# Altium schematic sheet Power.SchDoc
size A4; SheetNumber: 4; SheetTotal: 9
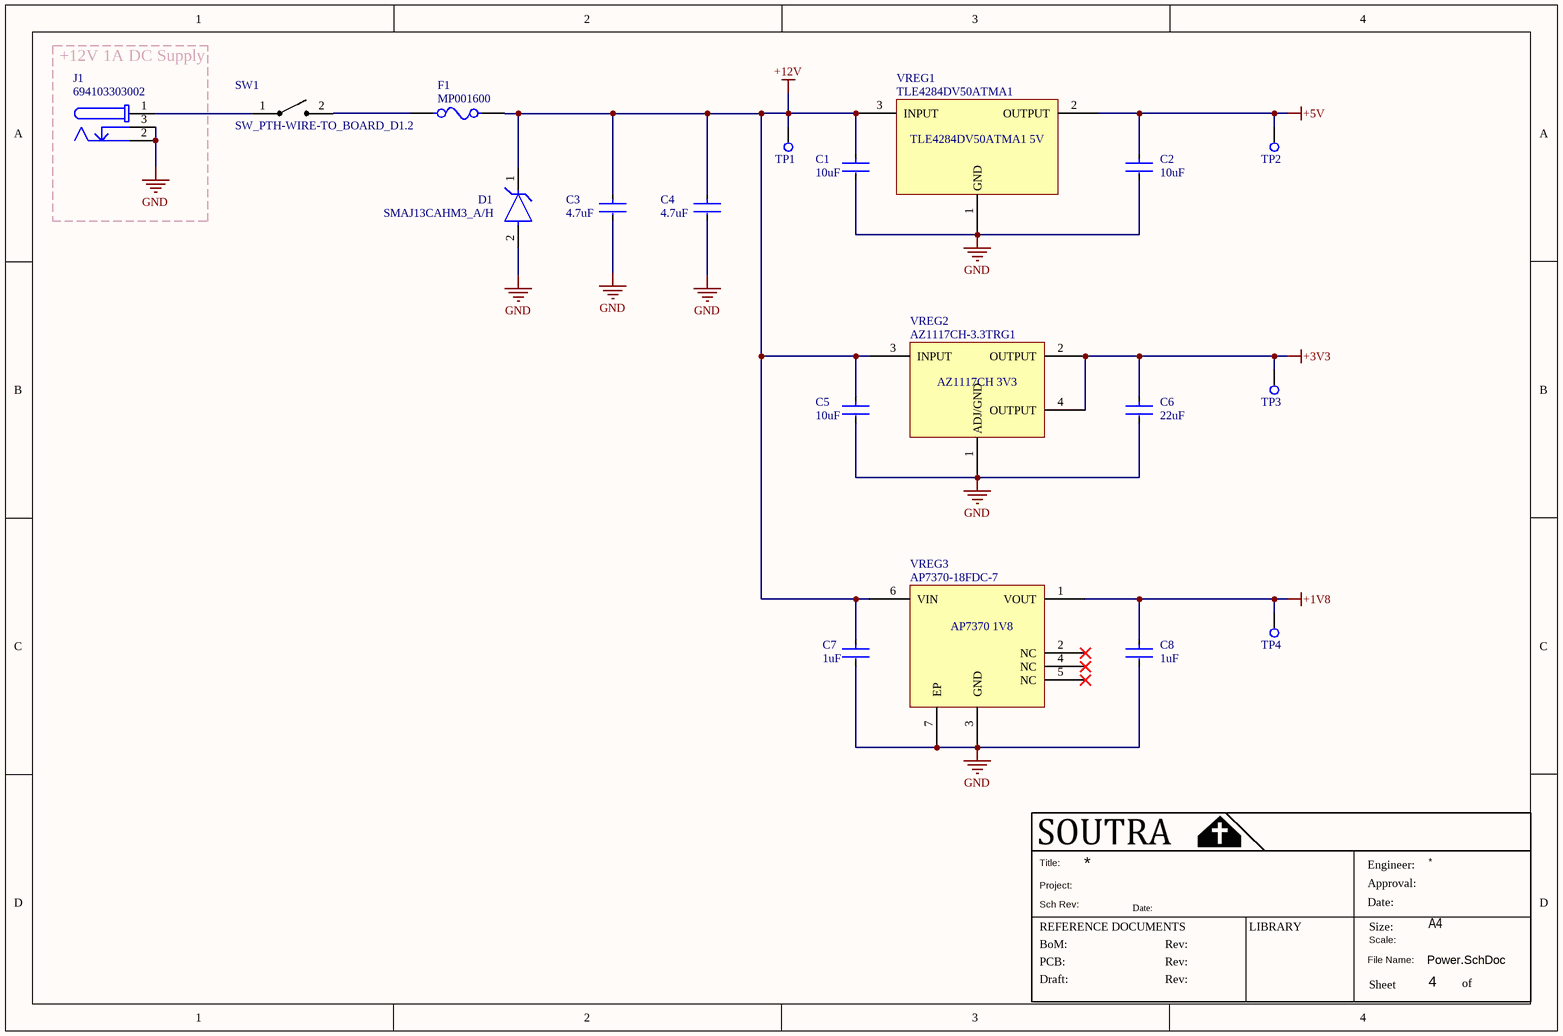
[diagram p0: Power.SchDoc]

## Parts
C1  value 10uF  [CC1206-IPC_A]  (hidden comment: 1206B106K250CP)
C2  value 10uF  [CC1206-IPC_A]  (hidden comment: 1206B106K250CP)
C3  value 4.7uF  [CC1206-IPC_A]  (hidden comment: CL31B475KAHNNNE)
C4  value 4.7uF  [CC1206-IPC_A]  (hidden comment: CL31B475KAHNNNE)
C5  value 10uF  [CC1206-IPC_A]  (hidden comment: 1206B106K250CP)
C6  value 22uF  [CAPC2012X14L]  (hidden comment: GRM21BR61A226ME51L)
C7  value 1uF  [CAPC1005X06L]  (hidden comment: CC0402KRX5R6BB105)
C8  value 1uF  [CAPC1005X06L]  (hidden comment: CC0402KRX5R6BB105)
D1  SMAJ13CAHM3_A/H  [SODFL511X229-2N]
F1  MP001600  [FUSE_3216X08L]
J1  694103303002  [WURTH_694106301002]
SW1  SW_PTH-WIRE-TO_BOARD_D1.2  [SW_PTH-Wire-to-Board-D1.2]
TP1  TP_CIRCLE_R1  [TP_CIRCLE_R1]  (value not drawn)
TP2  TP_CIRCLE_R1  [TP_CIRCLE_R1]  (value not drawn)
TP3  TP_CIRCLE_R1  [TP_CIRCLE_R1]  (value not drawn)
TP4  TP_CIRCLE_R1  [TP_CIRCLE_R1]  (value not drawn)
VREG1  TLE4284DV50ATMA1  [TO252-3-11_L]
VREG2  AZ1117CH-3.3TRG1  [SOT230P700X180-4L]
VREG3  AP7370-18FDC-7  [U-DFN2020EP65P201X201X63_HS-7L]

## Blocks framed on the sheet
+12V 1A DC Supply: J1

## Nets
+1V8: C8.1 TP4.1 VREG3.1(VOUT)
+3V3: C6.1 TP3.1 VREG2.2(OUTPUT) VREG2.4(OUTPUT)
+5V: C2.1 TP2.1 VREG1.2(OUTPUT)
+12V: C1.1 C3.1 C4.1 C5.1 C7.1 D1.1(C) F1.2 TP1.1 VREG1.3(INPUT) VREG2.3(INPUT) VREG3.6(VIN)
GND: C1.2 C2.2 C3.2 C4.2 C5.2 C6.2 C7.2 C8.2 D1.2(A) J1.2 J1.3 VREG1.1(GND) VREG2.1(ADJ/GND) VREG3.3(GND) VREG3.7(EP)
NetF1_1: F1.1 SW1.2
NetJ1_1: J1.1 SW1.1

Not connected (* = marked no-connect by the designer): VREG3 2(NC)* 4(NC)* 5(NC)*

## Notes on the sheet
- Title:
- Project:
- Sch Rev:
- Date:
- Engineer:
- Approval:
- REFERENCE DOCUMENTS
- BoM:
- PCB:
- Draft:
- Rev:
- LIBRARY
- File Name:
- Scale:
- Size:
- Sheet
- A4
- of
- (in symbol AP7370-18FDC-7) AP7370 1V8
- (in symbol AZ1117CH-3.3TRG1) AZ1117CH 3V3
- (in symbol TLE4284DV50ATMA1) TLE4284DV50ATMA1 5V

## Library data of the parts
C1 C2 C5 = 1206B106K250CP: Cap, 10Uf, 25V, Mlcc, 1206 Rohs Compliant: Yes; Manufacturer: Walsin Technologies; Supplier 1: Farnell; Supplier Part Number 1: 3764170; Manufacturer Part Number: 1206B106K250CP; RoHS: No; Stock 1: 1410; Pricing 1: 5=0.114, 50=0.11, 250=0.098, 500=0.096, 1000=0.094 (GBP)
C3 C4 = CL31B475KAHNNNE: Ceramic Capacitor, Multilayer, Ceramic, 25V, 10% +Tol, 10% -Tol, X7R, 15% TC, 4.7uF, Surface Mount, 1206; Manufacturer: Samsung; Multilayer: Yes; Supplier: Digikey; Supplier Part Number: 1276-1055-1-ND; Manufacturer Part Number: CL31B475KAHNNNE; RoHS: Yes; Category: Ceramic Capacitors; Stock: 245034; Pricing: 1=0.18, 10=0.116, 50=0.0732, 100=0.0585, 500=0.04228, 1000=0.0374 (USD); Mounting Technology: Surface Mount; Pins: 2; Dielectric Material: Ceramic; Package Shape: Rectangular; Case/Package: 1206; Terminal Finish: Nickel; Min Operating Temperature: -55°C; Max Operating Temperature: 125°C; JESD-609 Code: e3; Capacitor Type: Ceramic; Tolerance  (fill in as +-): 10%; Package Style: SMTMeter; Packaging: Tape and Reel; Tolerance (fill in as +-): 10%; Rated DC Voltage (URdc): 25V; Temperature Characteristics Code: X7R; Termination: Wraparound; Length: 3.2mm; Width: 1.6mm; Height: 1.8mm; Reach SVHC Compliant: Yes; RoHS Compliant: Yes; ComponentLink1URL: https://datasheet.ciiva.com:443/pdfs/VipMasterIC/IC/SEMS/SEMS-S-A0008522756/SEMS-S-A0008522493-1.pdf?src-supplier=IHS+Markit; ComponentLink1Description: https://datasheet.ciiva.com:443/pdfs/VipMasterIC/IC/SEMS/SEMS-S-A0008522756/SEMS-S-A0008522493-1.pdf?src-supplier=IHS+Markit; ComponentLink2URL: https://datasheet.ciiva.com/25728/cl31b475kahnnne-25728538.pdf?src-supplier=Digikey; ComponentLink2Description: https://datasheet.ciiva.com/25728/cl31b475kahnnne-25728538.pdf?src-supplier=Digikey; ComponentLink3URL: https://datasheet.ciiva.com/29200/452772-da-01-en-vs-kondensator-1206-29200897.pdf?src-supplier=Conrad; ComponentLink3Description: https://datasheet.ciiva.com/29200/452772-da-01-en-vs-kondensator-1206-29200897.pdf?src-supplier=Conrad; ComponentLink4URL: https://datasheet.ciiva.com/29200/452785-da-01-en-vs-kondensator-1206-29200901.pdf?src-supplier=Conrad; ComponentLink4Description: https://datasheet.ciiva.com/29200/452785-da-01-en-vs-kondensator-1206-29200901.pdf?src-supplier=Conrad; ComponentLink5URL: https://datasheet.ciiva.com/26310/mlcc-catalogdownload2013-eng-26310092.pdf?src-supplier=Distrelec; ComponentLink5Description: https://datasheet.ciiva.com/26310/mlcc-catalogdownload2013-eng-26310092.pdf?src-supplier=Distrelec; ComponentLink6URL: https://datasheet.ciiva.com/16428/cl10c1r5bb8nnnc-16428942.pdf?src-supplier=Future+Electronics; ComponentLink6Description: https://datasheet.ciiva.com/16428/cl10c1r5bb8nnnc-16428942.pdf?src-supplier=Future+Electronics; Supplier 1: Farnell; Supplier Part Number 1: 3013532; Pricing 1: 5=0.08, 50=0.05
C6 = GRM21BR61A226ME51L: SMD Multilayer Ceramic Capacitor, 22 µF, 10 V, 0805 [2012 Metric], ± 20%, X5R, GRM Series; Alternative Part: C2012X5R1A226M125AB; Alternative Part Manufacturer: TDK; Manufacturer: Murata; Supplier 1: Farnell; Supplier Part Number 1: 2494270; Pricing 1: 5=0.192, 50=0.09; Stock 1: 79616; Alternative Supplier: Digikey; Alternative Supplier Part Number: 490-10511-1-ND; Pricing 2: 1=0.22, 10=0.14, 50=0.09, 100=0.07; Alternative Part Supplier: Farnell; Alternative Part Supplier Part Number: 2525131; Manufacturer Part Number: GRM21BR61A226ME51L
C7 C8 = CC0402KRX5R6BB105: Ceramic Capacitor, Multilayer, Ceramic, 10V, 10% +Tol, 10% -Tol, X5R, 15% TC, 1uF, Surface Mount, 0402; Manufacturer: Yageo; Alternative Part: 0402ZD105KAT2A; Alternative Part Manufacturer: KYOCERA AVX; Multilayer: Yes; Supplier: Farnell; Supplier Part Number: 1458896; Manufacturer Part Number: CC0402KRX5R6BB105; RoHS: Yes; Category: Ceramic Capacitors; Stock: 12220000; Pricing: 10=0.039, 100=0.023; Mounting Technology: Surface Mount; Pins: 2; Dielectric Material: Ceramic; Package Shape: Rectangular; Case/Package: 0402; Terminal Finish: Nickel; Min Operating Temperature: -55°C; Max Operating Temperature: 85°C; JESD-609 Code: e3; Capacitor Type: Ceramic; Tolerance  (fill in as +-): 10%; Package Style: SMTMeter; Packaging: Tape and Reel; Tolerance (fill in as +-): 10%; Rated DC Voltage (URdc): 10V; Temperature Characteristics Code: X5R; Termination: Wraparound; Length: 1mm; Width: 0.5mm; Height: 0.5mm; Reach SVHC Compliant: Yes; RoHS Compliant: Yes; ComponentLink1URL: https://datasheet.ciiva.com:443/pdfs/VipMasterIC/IC/YAGO/YAGO-S-A0006851646/YAGO-S-A0006851646-1.pdf?src-supplier=IHS+Markit; ComponentLink1Description: https://datasheet.ciiva.com:443/pdfs/VipMasterIC/IC/YAGO/YAGO-S-A0006851646/YAGO-S-A0006851646-1.pdf?src-supplier=IHS+Markit; ComponentLink2URL: https://datasheet.ciiva.com/176/upy-gphc-x5r-4v-to-50v-12-176704.pdf?src-supplier=Digi-Key; ComponentLink2Description: https://datasheet.ciiva.com/176/upy-gphc-x5r-4v-to-50v-12-176704.pdf?src-supplier=Digi-Key; ComponentLink3URL: https://datasheet.ciiva.com/176/mlccorderingcode-176705.pdf?src-supplier=Digi-Key; ComponentLink3Description: https://datasheet.ciiva.com/176/mlccorderingcode-176705.pdf?src-supplier=Digi-Key; ComponentLink4URL: https://datasheet.ciiva.com/176/mlccorderingcode-176706.pdf?src-supplier=Digi-Key; ComponentLink4Description: https://datasheet.ciiva.com/176/mlccorderingcode-176706.pdf?src-supplier=Digi-Key; Supplier 1: Digikey; Supplier Part Number 1: 311-1439-1-ND; Pricing 1: 1=0.08, 10=0.058, 50=0.034, 100=0.027; Alternative Part Supplier: Farnell; Alternative Part Supplier Part Number: 1740588
D1 = SMAJ13CAHM3_A/H: TVS Diode, TRANSZORB SMAJ, Bidirectional, 13 V, 21.5 V, DO-214AC (SMA), 2 Pins; Manufacturer: Vishay; Supplier 1: Farnell; Supplier Part Number 1: 3530003; Pricing 1: 5=0.168, 10=0.146, 100+0.122; Stock 1: 8321; Manufacturer Part Number: SMAJ13CAHM3_A/H
F1 = MP001600: MULTICOMP PRO MP001600Fuse, Surface Mount, 1.5 A, Fast Acting, 72 VDC, 1206 [3216 Metric]; Supplier: Farnell; Supplier Part Number: 3285103; Manufacturer: Multicomp; Manufacturer Part Number: MP001600; RoHS: No; Stock: 2998; Pricing: 5=0.094, 50=0.0739, 250=0.0627, 500=0.0559, 1500=0.0459 (GBP)
J1 = 694103303002: Circular DC Power Connector; Manufacturer: Wurth Electronics; Connector Type: Circular,Power; Supplier: Farnell; Supplier Part Number: 2472149; Manufacturer Part Number: 694103303002; RoHS: Yes; Category: Connectors; Stock: 6324; Pricing: 1=1.14, 10=0.84, 100=0.78; Contact Finish - Mating: NOT SPECIFIED; Reach SVHC Compliant: Yes; RoHS Compliant: Yes; ComponentLink1URL: https://datasheet.ciiva.com:443/pdfs/VipMasterIC/IC/MIDC/MIDC-S-A0001193031/MIDC-S-A0001193031-1.pdf?src-supplier=IHS+Markit; ComponentLink1Description: https://datasheet.ciiva.com:443/pdfs/VipMasterIC/IC/MIDC/MIDC-S-A0001193031/MIDC-S-A0001193031-1.pdf?src-supplier=IHS+Markit; ComponentLink2URL: http://www.mouser.com/ds/2/445/6941xx303002-469289.pdf?src-supplier=Mouser; ComponentLink2Description: http://www.mouser.com/ds/2/445/6941xx303002-469289.pdf?src-supplier=Mouser; ComponentLink3URL: http://www.farnell.com/cad/2130963.pdf?src-supplier=Element14; ComponentLink3Description: http://www.farnell.com/cad/2130963.pdf?src-supplier=Element14; ComponentLink4URL: https://katalog.we-online.de/em/datasheet/6941xx303002.pdf?src-supplier=Digikey; ComponentLink4Description: https://katalog.we-online.de/em/datasheet/6941xx303002.pdf?src-supplier=Digikey; Supplier 1: Digikey; Supplier Part Number 1: 732-5930-ND; Stock 1: 11140; Pricing 1: 1=0.81, 10=0.77, 50=0.68, 100=0.63
SW1 = SW_PTH-WIRE-TO_BOARD_D1.2: PTH Mounting Holes for Wire-to-board switch, 1.2mm diameter, >=17AWG
TP1-TP4 = TP_CIRCLE_R1: Test Point, SMD, Circular, Radius = 1mm
VREG1 = TLE4284DV50ATMA1: Manufacturer: Infineon; Supplier 1: Farnell; Supplier Part Number 1: TLE4284DV50ATMA1; Pricing 1: 5=1.49, 50=1.38, 100=1.27; Stock 1: 24605; Manufacturer Part Number: TLE4284DV50ATMA1
VREG2 = AZ1117CH-3.3TRG1: Fixed Positive LDO Regulator, 3.3V, 1.3V Dropout, BIPolar, PDSO3; Manufacturer: Diodes; Package Body Material: Plastic; Dropout Voltage1-Nom: 1.2V; Input Voltage Absolute-Max: 18V; Max Supply Voltage: 15V; Line Regulation-Max: 0.01%; Load Regulation-Max: 0.015%; Channels: 1; Output Current1-Max: 800mA; Output Voltage1-Max: 3.365V; Output Voltage1-Min: 3.235V; Regulator Type: FIXED POSITIVE SINGLE OUTPUT LDO REGULATOR; Voltage Tolerance-Max: 1.97%; Qualification Status: Not Qualified; Supplier: Farnell; Supplier Part Number: 3483073; Manufacturer Part Number: AZ1117CH-3.3TRG1; RoHS: Yes; Category: Voltage Regulators - Linear; Stock: 8830; Pricing: 5=0.42, 10=0.25, 100=0.12; Case/Package: SOP; Pins: 3; Package Shape: Rectangular; Terminal Finish: Tin; JESD-609 Code: e3; Adjustability: FIXED; Dropout Voltage1-Max: 1.3V; JESD-30 Code: R-PDSO-G3; Moisture Sensitivity Level: 1; Number of Outputs: 1; Operating Temperature, TJ-Max: 125°C; Operating Temperature, TJ-Min: -20°C; Output Voltage1-Nom: 3.3V; Package Style: SMALL OUTLINEMeter; Packaging: Tape and Reel; Surface Mount: Yes; Technology: BIPOLAR; Terminal Form: Gull Wing; Terminal Position: DUAL; Length: 6.5mm; Width: 3.5mm; Terminal Pitch: 2.3mm; Height - Seated (Max): 1.8mm; Reach SVHC Compliant: Yes; RoHS Compliant: Yes; ComponentLink1URL: https://datasheet.ciiva.com:443/pdfs/VipMasterIC/IC/DIOD/DIOD-S-A0007713706/DIOD-S-A0007713706-1.pdf?src-supplier=IHS+Markit; ComponentLink1Description: https://datasheet.ciiva.com:443/pdfs/VipMasterIC/IC/DIOD/DIOD-S-A0007713706/DIOD-S-A0007713706-1.pdf?src-supplier=IHS+Markit; ComponentLink2URL: https://datasheet.ciiva.com/29569/az1117c-29569913.pdf?src-supplier=Digikey; ComponentLink2Description: https://datasheet.ciiva.com/29569/az1117c-29569913.pdf?src-supplier=Digikey; ComponentLink3URL: https://datasheet.ciiva.com/29569/az1117c-29569914.pdf?src-supplier=Digikey; ComponentLink3Description: https://datasheet.ciiva.com/29569/az1117c-29569914.pdf?src-supplier=Digikey; ComponentLink4URL: https://datasheet.ciiva.com/29569/az1117c-29569915.pdf?src-supplier=Digikey; ComponentLink4Description: https://datasheet.ciiva.com/29569/az1117c-29569915.pdf?src-supplier=Digikey; Supplier 1: Digikey; Supplier Part Number 1: AZ1117CH-3.3TRG1DICT-ND; Pricing 1: 1=0.36, 10=0.27, 25=0.23, 100=0.15
VREG3 = AP7370-18FDC-7: Fixed Positive LDO Regulator; Manufacturer: Diodes; Supplier: Farnell; Supplier Part Number: 3864505; Manufacturer Part Number: AP7370-18FDC-7; RoHS: Yes; Stock: 2900; Pricing: 5=0.53, 10=0.42, 100=0.23; Supplier 1: Mouser; Supplier Part Number 1: 621-AP7370-18FDC-7; Pricing 1: 1=0.38, 10=0.271, 100=0.19